# EAGLE design Megashield (EAGLE 5.10)
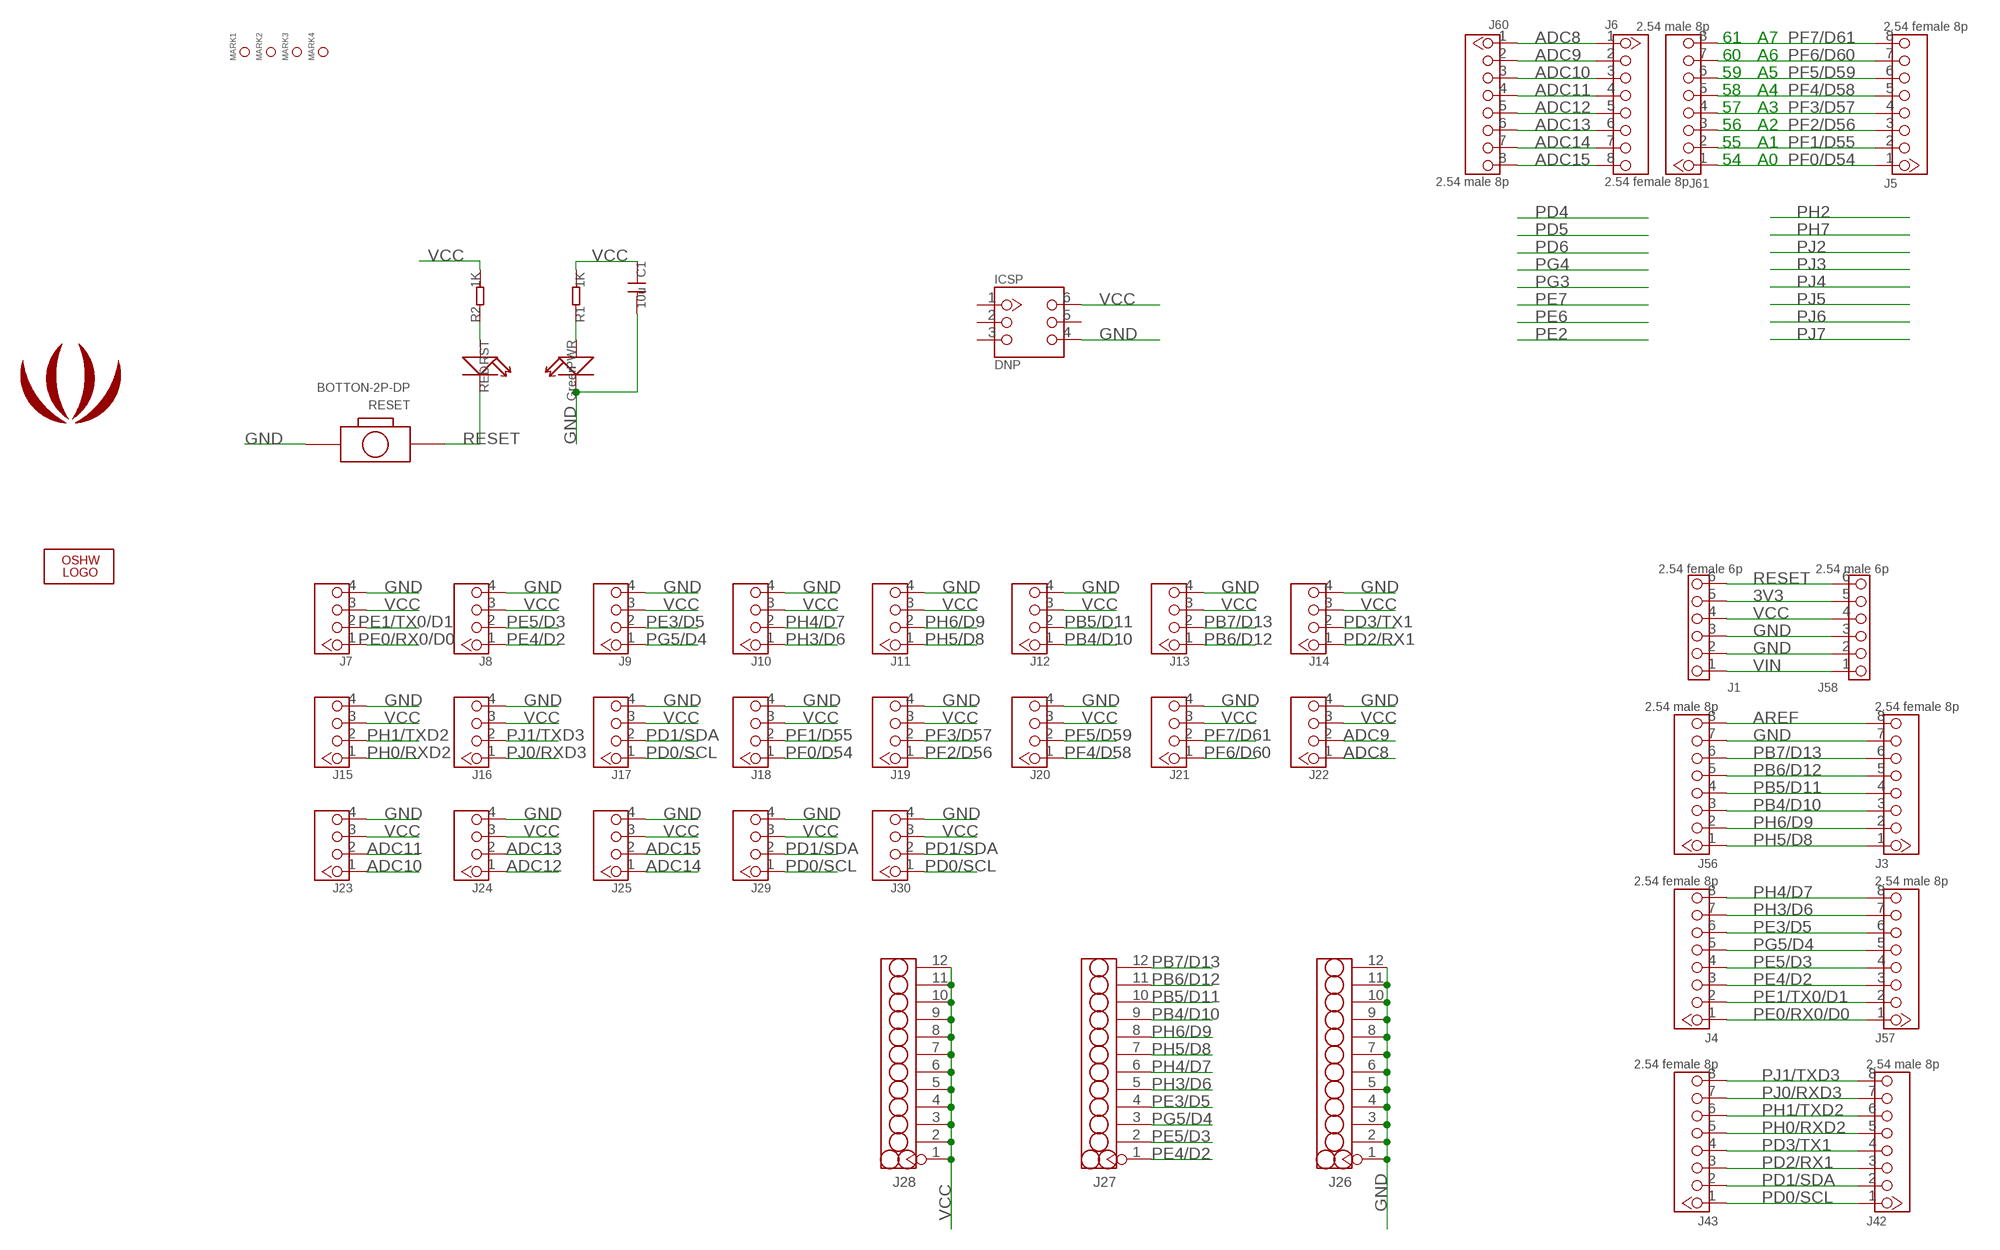
[diagram p0: schematic, sheet 1]

## Parts
C1  10u  C-0805  [0805]
ICSP  DNP  HEADER-2X3P'60/35'  [2X3P-2.54-LEADED-60/35]
J1  2.54 female 6p  HEADER-6P-LEADED-2.54  [6P-2.54-LEADED]
J3  2.54 female 8p  HEADER-8P-2.54-LEADED  [8P-2.54-LEADED]
J4  2.54 female 8p  HEADER-8P-2.54-LEADED  [8P-2.54-LEADED]
J5  2.54 female 8p  HEADER-8P-2.54-LEADED  [8P-2.54-LEADED]
J6  2.54 female 8p  HEADER-8P-2.54-LEADED  [8P-2.54-LEADED]
J7  TWIG-2.0-LEADED'90D'  [4P-LEADED-2.0-90]
J8  TWIG-2.0-LEADED  [4P-LEADED-2.0]
J9  TWIG-2.0-LEADED  [4P-LEADED-2.0]
J10  TWIG-2.0-LEADED  [4P-LEADED-2.0]
J11  TWIG-2.0-LEADED  [4P-LEADED-2.0]
J12  TWIG-2.0-LEADED  [4P-LEADED-2.0]
J13  TWIG-2.0-LEADED  [4P-LEADED-2.0]
J14  TWIG-2.0-LEADED'90D'  [4P-LEADED-2.0-90]
J15  TWIG-2.0-LEADED'90D'  [4P-LEADED-2.0-90]
J16  TWIG-2.0-LEADED'90D'  [4P-LEADED-2.0-90]
J17  TWIG-2.0-LEADED'90D'  [4P-LEADED-2.0-90]
J18  TWIG-2.0-LEADED  [4P-LEADED-2.0]
J19  TWIG-2.0-LEADED  [4P-LEADED-2.0]
J20  TWIG-2.0-LEADED  [4P-LEADED-2.0]
J21  TWIG-2.0-LEADED  [4P-LEADED-2.0]
J22  TWIG-2.0-LEADED  [4P-LEADED-2.0]
J23  TWIG-2.0-LEADED  [4P-LEADED-2.0]
J24  TWIG-2.0-LEADED  [4P-LEADED-2.0]
J25  TWIG-2.0-LEADED  [4P-LEADED-2.0]
J26  HEADER-12P-2.54  [12P-2.54-LEADED]
J27  HEADER-12P-2.54  [12P-2.54-LEADED]
J28  HEADER-12P-2.54  [12P-2.54-LEADED]
J29  TWIG-2.0-LEADED  [4P-LEADED-2.0]
J30  TWIG-2.0-LEADED  [4P-LEADED-2.0]
J42  2.54 male 8p  HEADER-8P-2.54-LEADED  [8P-2.54-LEADED]
J43  2.54 female 8p  HEADER-8P-2.54-LEADED  [8P-2.54-LEADED]
J56  2.54 male 8p  HEADER-8P-2.54-LEADED  [8P-2.54-LEADED]
J57  2.54 male 8p  HEADER-8P-2.54-LEADED  [8P-2.54-LEADED]
J58  2.54 male 6p  HEADER-6P-LEADED-2.54  [6P-2.54-LEADED]
J60  2.54 male 8p  HEADER-8P-2.54-LEADED  [8P-2.54-LEADED]
J61  2.54 male 8p  HEADER-8P-2.54-LEADED  [8P-2.54-LEADED]
LOGO1  LOGO-OSHW-FILLX0350-NT  [OSHW_FILLX350_NOTEXT]
MARK1  DNP  PAD-MARK-30  [MARK_30]
MARK2  DNP  PAD-MARK-30  [MARK_30]
MARK3  DNP  PAD-MARK-30  [MARK_30]
MARK4  DNP  PAD-MARK-30  [MARK_30]
PWR  Green  LED-0603  [D0603]
R1  1K  R-0402  [0402]
R2  1K  R-0402  [0402]
RESET  BOTTON-2P-DP  [BTN-5.0-RST]
RST  RED  LED-0603  [D0603]
U$1  LOGO-SEEEDSTUDIO-COPPER  [LOGO_COPPER]
U$2  LOGO-SEEEDSTUDIO-COPPER  [LOGO_COPPER]

## Nets
3V3: J1.5 J58.5
ADC8: J6.1 J22.1 J60.1
ADC9: J6.2 J22.2 J60.2
ADC10: J6.3 J23.1 J60.3
ADC11: J6.4 J23.2 J60.4
ADC12: J6.5 J24.1 J60.5
ADC13: J6.6 J24.2 J60.6
ADC14: J6.7 J25.1 J60.7
ADC15: J6.8 J25.2 J60.8
AREF: J3.8 J56.8
GND: C1.2 ICSP.4 J1.2 J1.3 J3.7 J7.4 J8.4 J9.4 J10.4 J11.4 J12.4 J13.4 J14.4 J15.4 J16.4 J17.4 J18.4 J19.4 J20.4 J21.4 J22.4 J23.4 J24.4 J25.4 J26.1 J26.2 J26.3 J26.4 J26.5 J26.6 J26.7 J26.8 J26.9 J26.10 J26.11 J26.12 J29.4 J30.4 J56.7 J58.2 J58.3 PWR.- RESET.P$2
N$1: PWR.+ R1.1
N$38: R2.1 RST.+
PB4/D10: J3.3 J12.1 J27.9 J56.3
PB5/D11: J3.4 J12.2 J27.10 J56.4
PB6/D12: J3.5 J13.1 J27.11 J56.5
PB7/D13: J3.6 J13.2 J27.12 J56.6
PD0/SCL: J17.1 J29.1 J30.1 J42.1 J43.1
PD1/SDA: J17.2 J29.2 J30.2 J42.2 J43.2
PD2/RX1: J14.1 J42.3 J43.3
PD3/TX1: J14.2 J42.4 J43.4
PE0/RX0/D0: J4.1 J7.1 J57.1
PE1/TX0/D1: J4.2 J7.2 J57.2
PE3/D5: J4.6 J9.2 J27.4 J57.6
PE4/D2: J4.3 J8.1 J27.1 J57.3
PE5/D3: J4.4 J8.2 J27.2 J57.4
PF0/D54: J5.1 J18.1 J61.1
PF1/D55: J5.2 J18.2 J61.2
PF2/D56: J5.3 J19.1 J61.3
PF3/D57: J5.4 J19.2 J61.4
PF4/D58: J5.5 J20.1 J61.5
PF5/D59: J5.6 J20.2 J61.6
PF6/D60: J5.7 J21.1 J61.7
PF7/D61: J5.8 J21.2 J61.8
PG5/D4: J4.5 J9.1 J27.3 J57.5
PH0/RXD2: J15.1 J42.5 J43.5
PH1/TXD2: J15.2 J42.6 J43.6
PH3/D6: J4.7 J10.1 J27.5 J57.7
PH4/D7: J4.8 J10.2 J27.6 J57.8
PH5/D8: J3.1 J11.1 J27.7 J56.1
PH6/D9: J3.2 J11.2 J27.8 J56.2
PJ0/RXD3: J16.1 J42.7 J43.7
PJ1/TXD3: J16.2 J42.8 J43.8
RESET: J1.6 J58.6 RESET.P$1 RST.-
VCC: C1.1 ICSP.6 J1.4 J7.3 J8.3 J9.3 J10.3 J11.3 J12.3 J13.3 J14.3 J15.3 J16.3 J17.3 J18.3 J19.3 J20.3 J21.3 J22.3 J23.3 J24.3 J25.3 J28.1 J28.2 J28.3 J28.4 J28.5 J28.6 J28.7 J28.8 J28.9 J28.10 J28.11 J28.12 J29.3 J30.3 J58.4 R1.2 R2.2
VIN: J1.1 J58.1
Unconnected: ICSP.1 ICSP.2 ICSP.3 ICSP.5

## Notes on the sheet
- 61 | A7
- 60 | A6
- 59 | A5
- 58 | A4
- 57 | A3
- 56 | A2
- 55 | A1
- 54 | A0

## Library data of the parts
C1 = Discrete:C*: Ceramic Capacitors
ICSP = Connector:HEADER-2X3P
J1 J58 = Connector:HEADER-6P
J3-J6 J42 J43 J56 J57 J60 J61 = Connector:HEADER-8P
J7-J25 J29 J30 = Connector:TWIG-2.0-LEADED
J26-J28 = Connector:HEADER-12P
LOGO1 = Logo:LOGO-OSHW-FILL
MARK1-MARK4 = Discrete:PAD-MARK
PWR RST = Discrete:LED*
R1 R2 = Discrete:R*
RESET = Discrete:BOTTON-2P
U$1 U$2 = Logo:LOGO-SEEEDSTUDIO

## Net classes
0 default: width 0.152 mm, drill 0.305 mm, clearance 0.152 mm

## Board
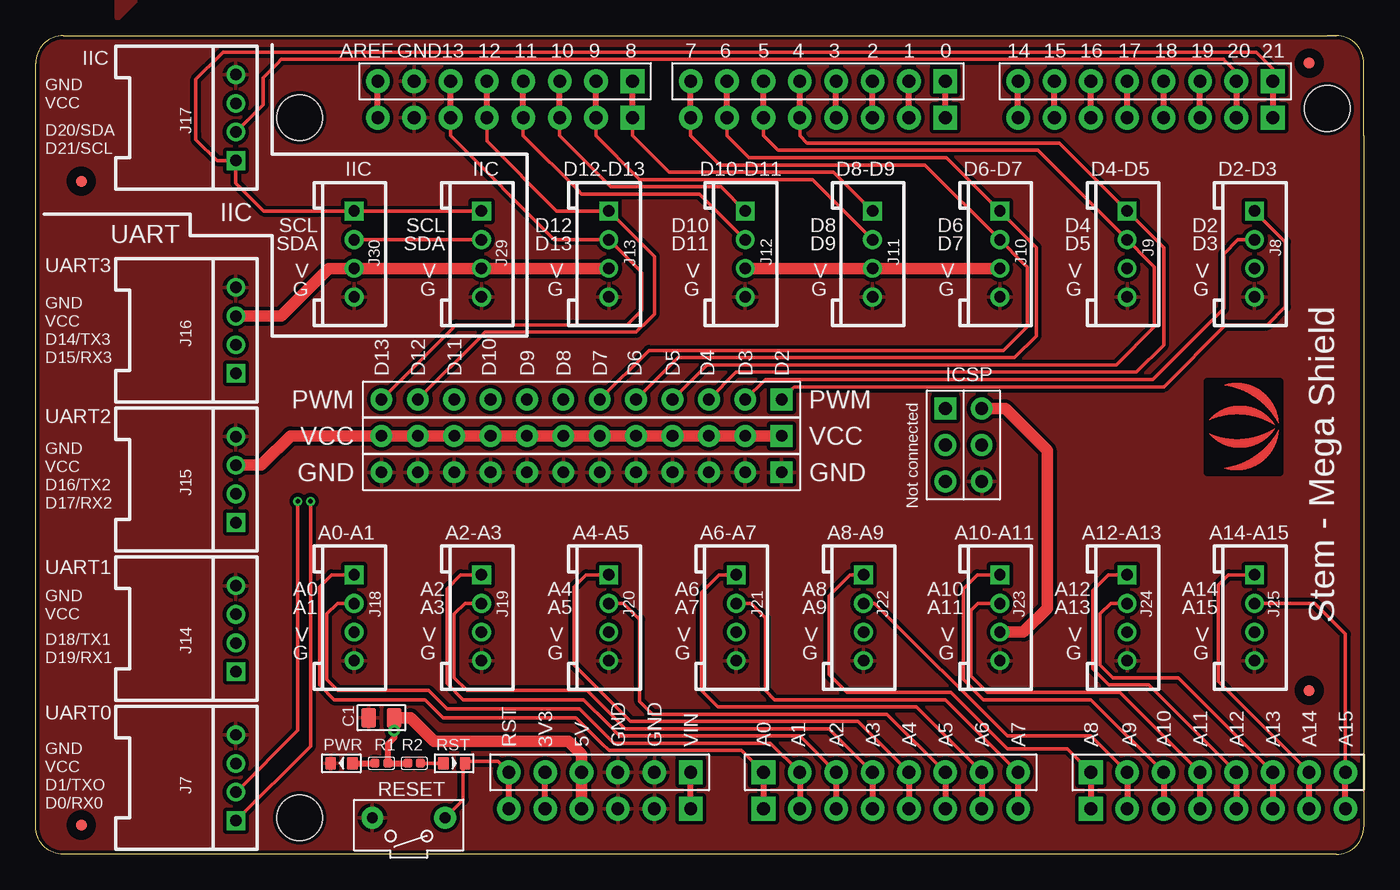
[diagram p1: board, top side]
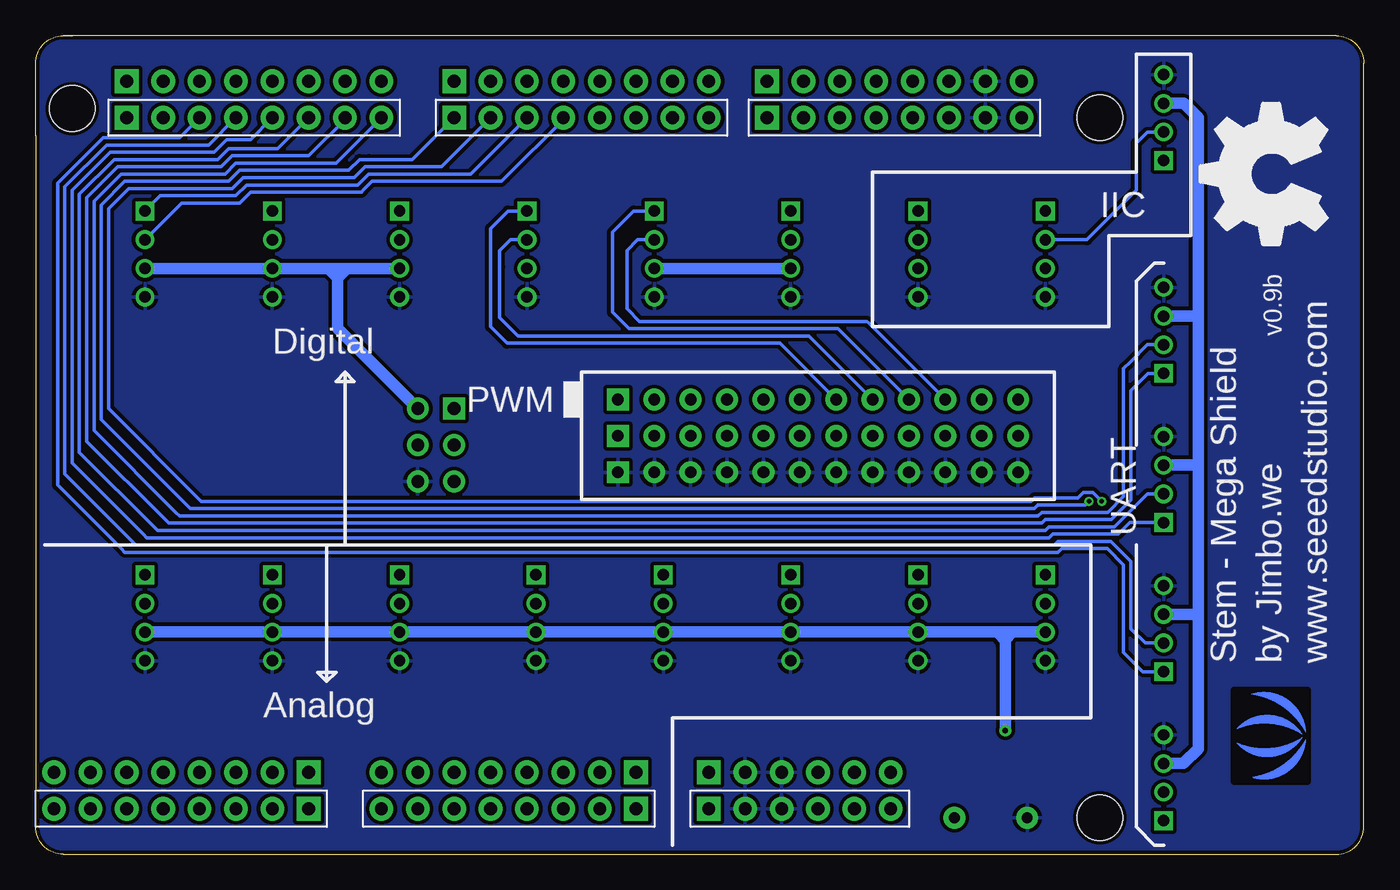
[diagram p2: board, bottom side, seen from below]

Size 92.71 x 57.15 mm. Coordinates in mm from the lower left corner, seen from the top.
Outline: 90.17,57.15 87.63,57.15 85.72,57.15 1.91,57.15 arc90 0,55.24 0,1.91 arc90 1.91,0 90.81,0 arc90 92.71,1.91 92.71,5.71 92.71,8.26 92.71,50.16 92.71,55.24 arc90 90.81,57.15
Outline: 90.17,57.15 90.81,57.15
Outline: 90.81,57.15 90.17,57.15
Copper layers (1*16): Top 0.035mm / dielectric 1.5mm / Bottom 0.035mm
Design rules "SeeedStudio_rule_no_angle_090911": minimum track width 6mil, minimum drill 12mil, track to track 6mil, track to pad 6mil, pad to pad 6mil, via to via 6mil, smd to smd 0mil, copper to edge 10mil, drill to drill 10mil, minimum pad ring 10mil, minimum via ring 6mil, stop-mask expansion 2mil, vias tented up to drill 100mil, thermal gap 10mil
Holes 3.2 mm at 90.17,52.07 18.41,51.44 18.41,2.54
tRestrict: area 81.8,26.7 to 86.9,33
bRestrict: area 3.9,5.1 to 9,11.4

### Footprints (pad centres in the part's own frame; a part is rotated, then mirrored left to right if it is on the bottom)
0805 = smd 1.016 x 1.397: 1 -0.889,0; 2 0.889,0
2X3P-2.54-LEADED-60/35 = drill 0.889 pad 1.524 square: 1 -1.27,2.54 | drill 0.889 pad 1.524 round: 2 -1.27,0; 3 -1.27,-2.54; 4 1.27,-2.54; 5 1.27,0; 6 1.27,2.54
6P-2.54-LEADED = drill 0.889 pad 1.651 square: 1 0,6.35 | drill 0.889 pad 1.651 round: 2 0,3.81; 3 0,1.27; 4 0,-1.27; 5 0,-3.81; 6 0,-6.35
8P-2.54-LEADED = drill 0.889 pad 1.651 square: 1 0,8.89 | drill 0.889 pad 1.651 round: 2 0,6.35; 3 0,3.81; 4 0,1.27; 5 0,-1.27; 6 0,-3.81; 7 0,-6.35; 8 0,-8.89
4P-LEADED-2.0-90 = drill 0.8 pad 1.27 square: 1 -3,0 | drill 0.8 pad 1.27 round: 2 -1,0; 3 1,0; 4 3,0
4P-LEADED-2.0 = drill 0.8 pad 1.27 square: 1 -3,0 | drill 0.8 pad 1.27 round: 2 -1,0; 3 1,0; 4 3,0
12P-2.54-LEADED = drill 0.813 pad 1.524 square: 1 0,13.97 | drill 0.813 pad 1.524 round: 2 0,11.43; 3 0,8.89; 4 0,6.35; 5 0,3.81; 6 0,1.27; 7 0,-1.27; 8 0,-3.81; 9 0,-6.35; 10 0,-8.89; 11 0,-11.43; 12 0,-13.97
MARK_30 = smd 0.762 x 0.762: MARK 0,0
D0603 = smd 0.762 x 0.889: + -0.762,0; - 0.762,0
0402 = smd 0.635 x 0.635: 1 -0.445,0; 2 0.445,0
BTN-5.0-RST = drill 0.762 pad 1.524 round: P$1 0,2.54; P$2 0,-2.54

### Placement (x,y rotation side)
C1  24.13,9.53 180 top
ICSP  64.77,28.57 0 top
J1  39.37,5.71 270 top
J3  32.77,53.98 270 top
J4  54.61,53.98 270 top
J5  59.69,5.71 90 top
J6  82.55,5.71 90 top
J7  13.97,5.33 90 top
J8  85.09,41.91 270 top
J9  76.2,41.91 270 top
J10  67.31,41.91 270 top
J11  58.42,41.91 270 top
J12  49.53,41.91 270 top
J13  40.01,41.91 270 top
J14  13.97,15.75 90 top
J15  13.97,26.16 90 top
J16  13.97,36.58 90 top
J17  13.97,51.44 90 top
J18  22.23,16.51 270 top
J19  31.11,16.51 270 top
J20  40.01,16.51 270 top
J21  48.9,16.51 270 top
J22  57.78,16.51 270 top
J23  67.31,16.51 270 top
J24  76.2,16.51 270 top
J25  85.09,16.51 270 top
J26  38.1,26.67 270 top
J27  38.1,31.75 270 top
J28  38.1,29.21 270 top
J29  31.11,41.91 270 top
J30  22.23,41.91 270 top
J42  77.47,51.44 90 bottom
J43  77.47,53.98 270 top
J56  32.77,51.44 90 bottom
J57  54.61,51.44 90 bottom
J58  39.37,3.17 90 bottom
J60  82.55,3.17 270 bottom
J61  59.69,3.17 270 bottom
LOGO1  2.54,42.55 90 bottom
MARK1  88.9,11.43 0 top
MARK2  88.9,55.24 0 top
MARK3  3.17,2.03 0 top
MARK4  3.17,46.99 0 top
PWR  21.34,6.35 180 top
R1  24.13,6.35 0 top
R2  26.42,6.35 180 top
RESET  26.04,2.54 270 top
RST  29.21,6.35 0 top
U$1  5.71,8.26 90 bottom
U$2  85.09,29.84 90 top

### Tracks (layer width: path | path; a pad name or v marks a point on that pad's centre or on a via)
3V3
  Top 0.406: J58.5 J1.5
  pour Top: 5.71,58.42 5.71,59.69 6.99,59.69
ADC8
  Top 0.254: J22.1 56.85,19.51 55.37,18.03 55.37,12.57 56.64,11.3 63.88,11.3 67.82,7.37 72.01,7.37 J6.1
  Top 0.406: J6.1 J60.1
ADC9
  Top 0.254: J22.2 58.56,17.51 67.82,8.26 73.66,8.26 J6.2
  Top 0.406: J6.2 J60.2
ADC10
  Top 0.254: J23.1 65.74,19.51 64.9,18.67 64.77,18.54 64.77,12.19 66.17,10.79 73.66,10.79 J6.3
  Top 0.406: J6.3 J60.3
ADC11
  Top 0.254: J6.4 75.69,11.3 66.42,11.3 65.28,12.45 65.28,17.02 65.79,17.53 67.29,17.53 J23.2
  Top 0.406: J6.4 J60.4
ADC12
  Top 0.254: J6.5 77.72,11.81 74.93,11.81 73.91,12.83 73.79,12.95 73.79,18.41 74.74,19.37 | 74.74,19.37 74.8,19.43 | J24.1 74.88,19.51 74.74,19.37
  Top 0.406: J6.5 J60.5
ADC13
  Top 0.254: J6.6 79.76,12.32 75.18,12.32 74.3,13.21 74.3,16.76 75.06,17.53 76.18,17.53 J24.2
  Top 0.406: J6.6 J60.6
ADC14
  Top 0.254: J6.7 82.55,12.06 82.55,18.8 83.26,19.51 J25.1
  Top 0.406: J60.7 J6.7
ADC15
  Top 0.254: J25.2 89.3,17.51 91.44,15.37 J6.8
  Top 0.406: J60.8 J6.8
AREF
  Top 0.406: J56.8 J3.8
GND
  pour Bottom (isolate 0.254, rank 6): 0,57.15 92.71,57.15 92.71,0 0,0
  pour Top (isolate 0.254, rank 6): 0,57.15 92.71,57.15 92.71,0 0,0
N$1
  Top 0.406: PWR.+ R1.1
N$38
  Top 0.254: R2.1 RST.+
PB4/D10
  Top 0.254: J56.3 36.58,50.16 40.13,46.61 47.75,46.61 47.83,46.61 J12.1
  Top 0.406: J56.3 J3.3
  Bottom 0.254: J27.9 36.7,36.7 51.31,36.7 52.45,37.85 52.45,41.99 52.45,43.43 50.98,44.91 J12.1
PB5/D11
  Top 0.254: J56.4 34.04,50.16 37.85,46.35 38.1,46.1 46.34,46.1 J12.2
  Top 0.406: J56.4 J3.4
  Bottom 0.254: J27.10 34.54,37.08 34.67,37.21 50.55,37.21 51.44,38.1 51.44,41.01 51.44,42.16 50.69,42.91 J12.2
PB6/D12
  Top 0.254: J27.11 31.11,36.2 31.24,36.32 31.37,36.45 41.91,36.45 42.8,37.34 43.18,37.72 43.18,41.73 J13.1 36.37,44.91 36.32,44.96 31.5,49.78 J56.5
  Top 0.406: J56.5 J3.5
PB7/D13
  Top 0.254: J27.12 29.08,36.7 29.21,36.83 29.34,36.96 41.27,36.96 42.29,37.97 42.29,40.62 42.04,40.88 J13.2 39.99,42.93 38.1,42.93 | 38.1,42.93 36.2,42.93 | 38.1,42.93 36.2,42.93 | J56.6 28.96,50.16 36.2,42.93
  Top 0.406: J56.6 J3.6
PD0/SCL
  Top 0.254: J29.1 J30.1 15.92,44.91 13.97,46.86 J17.1 12.65,48.44 11.18,49.91 11.18,50.29 11.18,54.1 12.83,55.75 13.08,56.01 85.22,56.01 85.47,55.75 86.36,54.86 J43.1
  Top 0.406: J43.1 J42.1
PD1/SDA
  Top 0.254: J30.2 J29.2 | J43.2 83.82,54.1 83.82,54.61 83.19,55.24 83.06,55.37 82.93,55.5 17.14,55.5 16.89,55.24 15.88,54.23 15.88,52.34 J17.2
  Top 0.406: 83.82,54.1 J42.2
  Bottom 0.254: J30.2 19.32,42.91 15.88,46.35 15.88,48.53 15.88,49.66 15.11,50.42 13.99,50.42 J17.2
PD2/RX1
  Top 0.406: J42.3 J43.3
  Bottom 0.254: J42.3 82.68,50.04 88.01,50.04 91.19,46.86 91.19,46.35 91.19,25.78 86.74,21.34 86.49,21.08 86.23,21.08 21.34,21.08 21.08,21.34 17.91,21.34 16.76,20.19 16.76,14.1 15.41,12.75 J14.1
PD3/TX1
  Top 0.406: J42.4 J43.4
  Bottom 0.254: J42.4 80.64,49.53 87.12,49.53 87.76,49.53 90.68,46.61 90.68,45.97 90.68,26.54 85.98,21.84 85.72,21.59 21.59,21.59 21.34,21.84 17.65,21.84 16.26,20.45 16.26,15.75 15.26,14.75 J14.2
PE0/RX0/D0  (via drill 0.3 pad 0.64)
  Top 0.254: v19.18,24.64 19.18,20.57 19.18,7.54 J7.1
  Top 0.406: J57.1 J4.1
  Bottom 0.254: J57.1 66.42,48.51 69.47,48.51 70.1,48.51 70.87,47.75 70.99,47.75 78.49,47.75 79.25,46.99 85.85,46.99 86.49,46.99 88.14,45.34 88.14,44.7 88.14,30.35 82.17,24.38 81.92,24.13 22.99,24.13 22.73,24.38 19.43,24.38 v19.18,24.64
PE1/TX0/D1  (via drill 0.3 pad 0.64)
  Top 0.254: v18.29,24.64 18.29,20.57 18.29,8.64 13.99,4.33 J7.2
  Top 0.406: J57.2 J4.2
  Bottom 0.254: J57.2 64.39,48.01 69.22,48.01 69.72,48.01 70.48,47.24 70.87,47.24 78.23,47.24 78.99,46.48 85.47,46.48 86.23,46.48 87.63,45.09 87.63,44.32 87.63,31.11 81.41,24.89 81.15,24.64 23.37,24.64 23.24,24.64 22.99,24.89 19.94,24.89 19.56,25.27 18.92,25.27 v18.29,24.64
PE3/D5
  Top 0.254: J27.4 46.86,34.16 75.44,34.16 78.11,36.83 78.11,41.01 77.72,41.39 J9.2 69.96,49.15 51.82,49.15 50.8,50.16 J57.6
  Top 0.406: J57.6 J4.6
PE4/D2
  Top 0.254: J27.1 52.83,32.51 52.96,32.64 78.74,32.64 83.06,36.96 85.98,36.96 87.25,38.23 87.25,42.75 J8.1
  Top 0.406: J57.3 J4.3
  Bottom 0.254: J57.3 62.23,47.62 62.36,47.5 69.47,47.5 70.1,46.86 70.23,46.74 77.98,46.74 78.74,45.97 84.03,45.97 J8.1
PE5/D3
  Top 0.254: J27.2 50.93,33.15 51.05,33.15 77.98,33.15 80.14,35.31 82.93,38.1 82.93,41.91 83.93,42.91 J8.2
  Top 0.406: J57.4 J4.4
  Bottom 0.254: J57.4 55.88,51.31 59.94,47.24 60.07,47.12 60.2,46.99 69.22,46.99 69.85,46.35 69.98,46.23 77.72,46.23 78.49,45.47 82.53,45.47 J8.2
PF0/D54
  Top 0.254: J18.1 20.65,19.51 19.81,18.67 19.81,11.81 20.83,10.79 27.18,10.79 28.45,9.53 37.72,9.53 39.5,7.75 40.01,7.24 49.28,7.24 J5.1
  Top 0.406: J5.1 J61.1
PF1/D55
  Top 0.254: J18.2 21.07,17.51 20.32,16.76 20.32,12.19 21.08,11.43 27.43,11.43 28.7,10.16 37.97,10.16 39.75,8.38 40.39,7.75 51.31,7.75 J5.2
  Top 0.406: J5.2 J61.2
PF2/D56
  Top 0.254: J19.1 29.67,19.51 28.7,18.54 28.7,11.94 29.84,10.79 38.23,10.79 40.01,9.02 40.64,8.38 40.77,8.26 53.34,8.26 J5.3
  Top 0.406: J5.3 J61.3
PF3/D57
  Top 0.254: J19.2 29.96,17.51 29.21,16.76 29.21,12.32 30.1,11.43 38.48,11.43 40.26,9.65 41.15,8.76 55.37,8.76 J5.4
  Top 0.406: J5.4 J61.4
PF4/D58
  Top 0.254: J20.1 38.43,19.51 37.59,18.67 37.59,13.21 40.51,10.29 41.53,9.27 57.4,9.27 J5.5
  Top 0.406: J5.5 J61.5
PF5/D59
  Top 0.254: J20.2 41.04,17.51 42.16,16.38 42.16,10.67 43.05,9.78 59.44,9.78 J5.6
  Top 0.406: J5.6 J61.6
PF6/D60
  Top 0.254: J21.1 47.7,19.51 46.48,18.29 46.48,11.43 47.62,10.29 61.47,10.29 J5.7
  Top 0.406: J5.7 J61.7
PF7/D61
  Top 0.254: J21.2 49.93,17.51 50.93,16.51 50.93,11.43 51.56,10.79 63.5,10.79 J5.8
  Top 0.406: J5.8 J61.8
PG5/D4
  Top 0.254: J27.3 48.9,33.66 76.83,33.66 78.74,35.56 78.74,42.37 78.22,42.89 J9.1 71.45,49.66 53.85,49.66 53.34,50.16 J57.5
  Top 0.406: J57.5 J4.5
PH0/RXD2
  Top 0.406: J42.5 J43.5
  Bottom 0.254: J42.5 77.72,49.91 78.87,49.91 79.38,49.91 80.26,49.02 80.64,49.02 86.87,49.02 87.5,49.02 90.17,46.35 90.17,45.72 90.17,27.3 85.22,22.35 84.96,22.1 21.97,22.1 21.72,22.35 17.14,22.35 16.34,23.16 J15.1
PH1/TXD2
  Top 0.406: J42.6 J43.6
  Bottom 0.254: J42.6 75.82,49.28 78.49,49.28 79.25,49.28 80.01,48.51 80.64,48.51 86.61,48.51 87.25,48.51 89.66,46.1 89.66,45.47 89.66,28.07 84.45,22.86 84.2,22.61 22.23,22.61 21.97,22.86 17.4,22.86 15.1,25.16 J15.2
PH3/D6
  Top 0.254: J27.5 44.83,34.67 68.33,34.67 69.85,36.2 69.85,42.37 69.48,42.74 J10.1 63.58,48.64 49.78,48.64 48.26,50.16 J57.7
  Top 0.406: J57.7 J4.7
PH4/D7
  Top 0.254: J27.6 42.8,35.18 67.56,35.18 69.22,36.83 69.22,41.01 68.97,41.26 J10.2 62.09,48.13 47.75,48.13 45.72,50.16 J57.8
  Top 0.406: J57.8 J4.8
PH5/D8
  Top 0.254: J56.1 41.66,50.16 44.2,47.62 55.7,47.62 J11.1
  Top 0.406: J56.1 J3.1
  Bottom 0.254: 60.96,42.29 60.96,36.83 59.82,35.69 40.77,35.69 J27.7 | 60.96,42.29 60.96,42.37 | J11.1 59.74,44.91 60.96,43.69 60.96,42.29
PH6/D9
  Top 0.254: J56.2 39.12,50.16 42.16,47.12 54.21,47.12 J11.2
  Top 0.406: J56.2 J3.2
  Bottom 0.254: J27.8 38.73,36.2 59.05,36.2 60.33,37.47 60.33,41.01 60.33,42.16 59.58,42.91 J11.2
PJ0/RXD3
  Top 0.406: J42.7 J43.7
  Bottom 0.254: J42.7 71.12,51.31 73.66,48.77 77.98,48.77 78.99,48.77 79.76,48.01 80.9,48.01 86.36,48.01 86.49,48.01 87,48.01 89.15,45.85 89.15,45.21 89.15,28.83 83.69,23.37 83.44,23.11 22.48,23.11 22.23,23.37 17.63,23.37 16.26,24.75 16.26,32.38 15.06,33.58 J16.1
PJ1/TXD3
  Top 0.406: J42.8 J43.8
  Bottom 0.254: J42.8 71.75,48.26 77.6,48.26 78.74,48.26 79.5,47.5 80.39,47.5 86.11,47.5 86.74,47.5 88.65,45.59 88.65,44.96 88.65,29.59 82.93,23.88 82.68,23.62 22.73,23.62 22.48,23.88 17.87,23.88 16.76,24.98 16.76,33.91 16.26,34.42 15.1,35.58 J16.2
RESET
  Top 0.254: RESET.P$1 29.84,3.81 29.84,6.22 RST.- 30.1,6.48 32.26,6.48 J1.6
  Top 0.406: J1.6 J58.6
VCC  (via drill 0.38 pad 0.81)
  Top 0.406: R2.2 R1.2 24.57,7.68 25.02,8.13 v25.02,8.64 C1.1
  Top 0.813: J58.4 J1.4 38.23,5.84 38.1,5.97 38.1,6.99 37.21,7.87 27.81,7.87 26.16,9.53 C1.1 v25.02,8.64 | J16.3 17.13,37.58 20.45,40.89 22.21,40.89 J30.3 J29.3 J13.3 | J12.3 J11.3 J10.3 | J28.1 J28.2 J28.3 J28.4 J28.5 J28.6 J28.7 J28.8 J28.9 J28.10 J28.11 J28.12 17.78,29.21 15.88,27.3 15.73,27.16 J15.3 | ICSP.6 67.69,31.11 70.61,28.19 70.61,17.16 68.96,15.51 J23.3
  Bottom 0.813: J13.3 J12.3 | J10.3 71.5,40.91 | 71.5,40.91 J9.3 J8.3 | 71.63,40.26 71.63,40.78 71.5,40.91 | 71.63,40.26 70.99,40.89 | 71.63,40.26 71.63,36.7 ICSP.6 | 71.63,40.26 72.26,40.89 | 11.56,16.76 11.56,8.75 11.56,7.37 12.59,6.33 J7.3 | 11.56,16.76 11.56,27.18 | 11.56,27.18 11.56,37.47 | 11.56,37.47 11.56,49.91 | 11.56,49.91 11.56,50.02 | J25.3 J24.3 J23.3 J22.3 J21.3 J20.3 J19.3 24.51,15.51 | 11.56,16.76 11.57,16.75 J14.3 | 11.56,27.18 11.57,27.16 J15.3 | J16.3 11.67,37.58 11.56,37.47 | 24.51,15.51 J18.3 | v25.02,8.64 25.02,14.61 25.02,14.86 | 25.02,14.86 25.53,15.49 25.02,14.86 | 25.02,14.86 25.02,15 24.51,15.51 | J17.3 12.56,52.44 11.56,51.44 11.56,49.91
VIN
  Top 0.406: J58.1 J1.1

### Text on the board
tPlace: IIC | AREF | GND | 13 | 12 | 11 | 10 | 9 | 8 | 7 | 6 | 5 | 4 | 3 | 2 | 1 | 0 | 14 | 15 | 16 | 17 | 18 | 19 | 20 | 21 | GND | VCC | D20/SDA | D21/SCL | IIC | IIC | D12-D13 | D10-D11 | D8-D9 | D6-D7 | D4-D5 | D2-D3 | IIC | SCL | SCL | D12 | D10 | D8 | D6 | D4 | D2 | UART | SDA | SDA | D13 | D11 | D9 | D7 | D5 | D3 | UART3 | V | V | V | V | V | V | V | V | G | G | G | G | G | G | G | G | GND | VCC | D14/TX3 | D15/RX3 | D13 | D12 | D11 | D10 | D9 | D8 | D7 | D6 | D5 | D4 | D3 | D2 | PWM | PWM | UART2 | VCC | VCC | GND | VCC | GND | GND | D16/TX2 | D17/RX2 | Not connected | A0-A1 | A2-A3 | A4-A5 | A6-A7 | A8-A9 | A10-A11 | A12-A13 | A14-A15 | UART1 | A0 | A2 | A4 | A6 | A8 | A10 | A12 | A14 | GND | A1 | A3 | A5 | A7 | A9 | A11 | A13 | A15 | VCC | V | V | V | V | V | V | V | V | Stem - Mega Shield | D18/TX1 | G | G | G | G | G | G | G | G | D19/RX1 | UART0 | GND | RST | RST | 3V3 | 5V | GND | GND | VIN | A0 | A1 | A2 | A3 | A4 | A5 | A6 | A7 | A8 | A9 | A10 | A11 | A12 | A13 | A14 | A15 | VCC | D1/TXO | D0/RX0
bPlace: IIC | v0.9b | Digital | PWM | UART | www.seeedstudio.com | by Jimbo.we | Stem - Mega Shield | Analog
tValues: Micro USB